# Altium schematic sheet seven_segment_driver_sche.SchDoc
size A
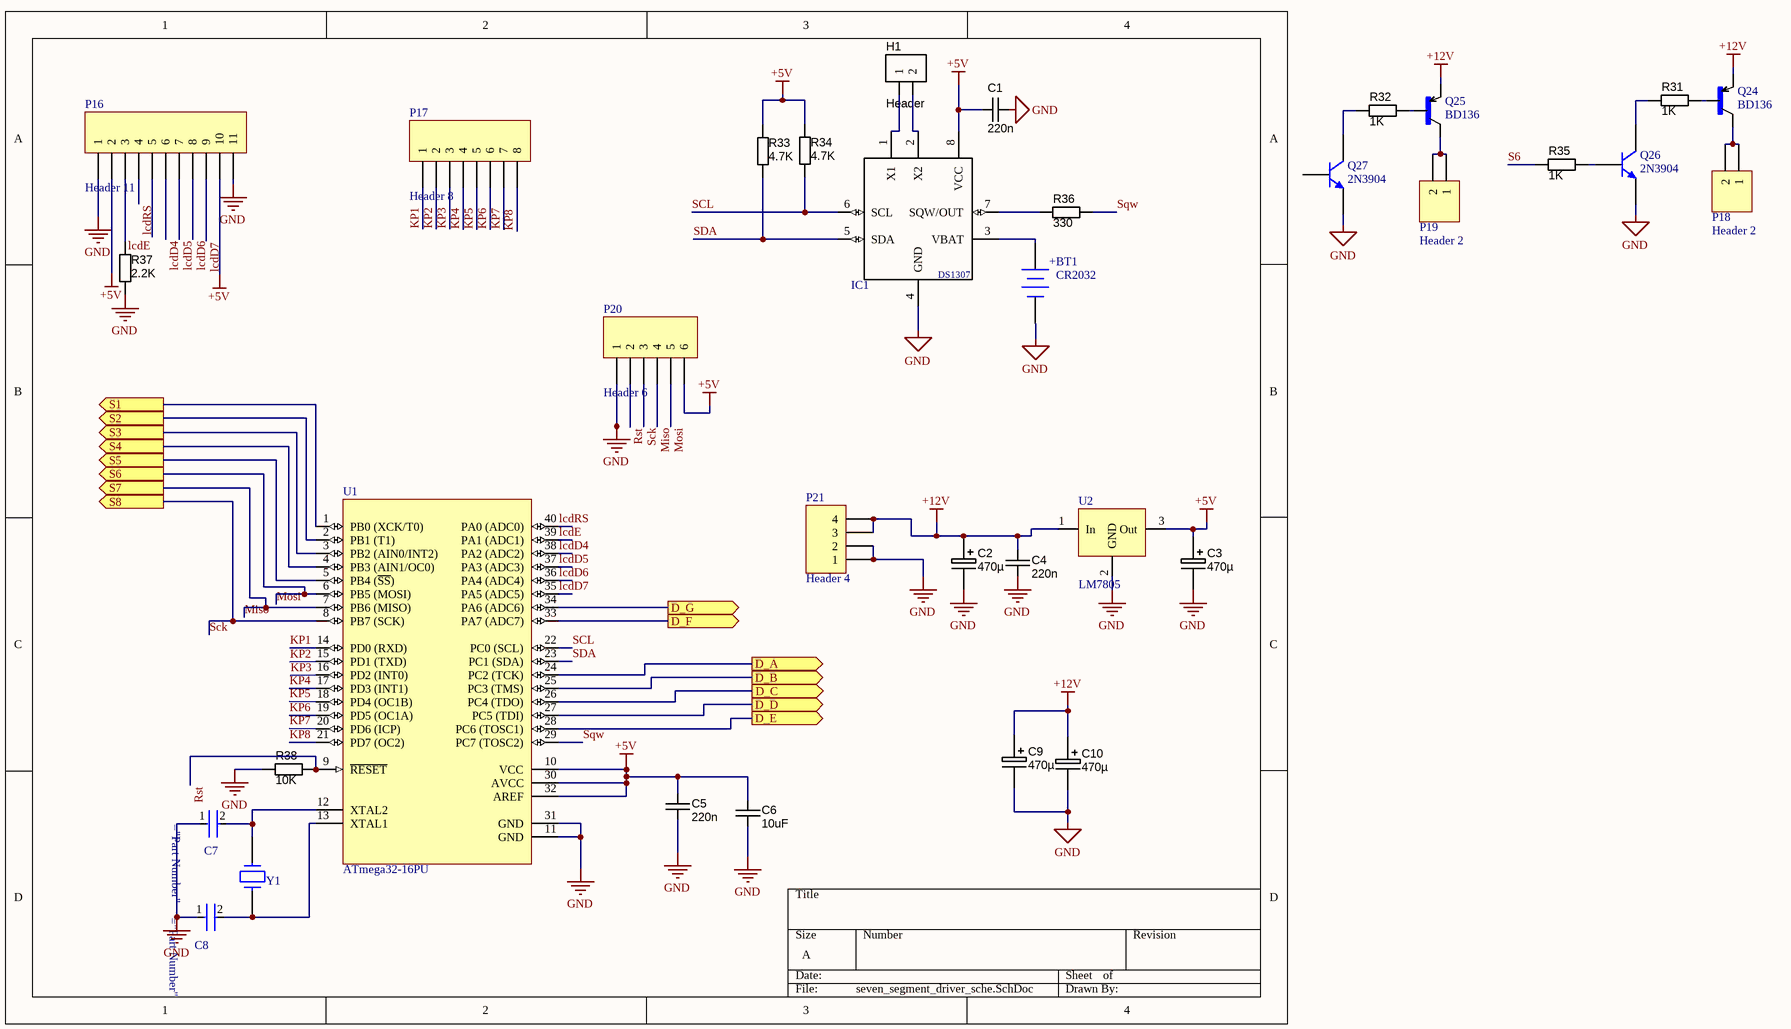
[diagram p0: seven_segment_driver_sche.SchDoc]

## Parts
BT1  CR2032  [CR2032 CELL HOLDER]
C1  value 220n  [CAPC500P450250X550]  (hidden comment: approved sub OK)
C2  470µ  [CAPE10.0MM_Rad_10x14mm]
C3  470µ  [CAPE10.0MM_Rad_10x14mm]
C4  value 220n  [CAPC500P450250X550]  (hidden comment: approved sub OK)
C5  value 220n  [CAPC500P450250X550]  (hidden comment: approved sub OK)
C6  value 10uF  [CAPE_5x11x2LS]  (hidden comment: approved sub OK)
C7  K220J15C0GF5TH5  [Vishay_K220J15_0]  (value not drawn)
C8  K220J15C0GF5TH5  [Vishay_K220J15_0]  (value not drawn)
C9  470µ  [CAPE10.0MM_Rad_10x14mm]
C10  470µ  [CAPE10.0MM_Rad_10x14mm]
H1  Header  [HDR_1x2_Offset]  (no BOM)
IC1  DS1307  [DIP8-300]  (value not drawn)
P16  Header 11  [HDR1X11]
P17  Header 8  [HDR1X8]
P18  Header 2  [HDR1X2]
P19  Header 2  [HDR1X2]
P20  Header 6  [HDR1X6]
P21  Header 4  [HDR1X4]
Q24  BD136  [*TO229P780X300X2000-3]
Q25  BD136  [*TO229P780X300X2000-3]
Q26  2N3904  [TO-92_Flat]
Q27  2N3904  [TO-92_Flat]
R31  value 1K  [RESTH_AXIAL-0.4]  (hidden comment: Carbon Film)
R32  value 1K  [RESTH_AXIAL-0.4]  (hidden comment: Carbon Film)
R33  value 4.7K  [RESTH_AXIAL-0.4]  (hidden comment: Carbon Film)
R34  value 4.7K  [RESTH_AXIAL-0.4]  (hidden comment: Carbon Film)
R35  value 1K  [RESTH_AXIAL-0.4]  (hidden comment: Carbon Film)
R36  value 330  [RESTH_AXIAL-0.4]  (hidden comment: Carbon Film)
R37  value 2.2K  [RESTH_AXIAL-0.4]  (hidden comment: Carbon Film)
R38  value 10K  [RESTH_AXIAL-0.4]  (hidden comment: Carbon Film)
U1  ATmega32-16PU  [40P6]
U2  LM7805  [To-254-AA]
Y1  4MHz  [Cristal mini]  (value not drawn)

## Ports
D_A (out), D_B (out), D_C (out), D_D (out), D_E (out), D_F (out), D_G (out), S1 (out), S2 (out), S3 (out), S4 (out), S5 (out), S6 (out), S7 (out), S8 (out)

## Nets
+5V: C1.1 C3.1 C5.1 C6.1 IC1.8(VCC) P16.2 P16.10 P20.6 R33.2 R34.2 U1.10(VCC) U1.30(AVCC) U1.32(AREF) U2.3(Out)
+12V: C2.1 C4.2 C9.1 C10.1 P21.3 P21.4 Q24.1(C) Q25.1(C) U2.1(In)
GND: BT1.2(-) C1.2 C2.2 C3.2 C4.1 C5.2 C6.2 C7.1 C8.1 C9.2 C10.2 IC1.4(GND) P16.1 P16.11 P20.1 P21.1 P21.2 Q26.1(E) Q27.1(E) R37.1 R38.1 U1.11(GND) U1.31(GND) U2.2(GND)
D_A: U1.24(PC2_(TCK)) ; port D_A
D_B: U1.25(PC3_(TMS)) ; port D_B
D_C: U1.26(PC4_(TDO)) ; port D_C
D_D: U1.27(PC5_(TDI)) ; port D_D
D_E: U1.28(PC6_(TOSC1)) ; port D_E
D_F: U1.33(PA7_(ADC7)) ; port D_F
D_G: U1.34(PA6_(ADC6)) ; port D_G
KP1: P17.1 U1.14(PD0_(RXD))
KP2: P17.2 U1.15(PD1_(TXD))
KP3: P17.3 U1.16(PD2_(INT0))
KP4: P17.4 U1.17(PD3_(INT1))
KP5: P17.5 U1.18(PD4_(OC1B))
KP6: P17.6 U1.19(PD5_(OC1A))
KP7: P17.7 U1.20(PD6_(ICP))
KP8: P17.8 U1.21(PD7_(OC2))
lcdD4: P16.6 U1.38(PA2_(ADC2))
lcdD5: P16.7 U1.37(PA3_(ADC3))
lcdD6: P16.8 U1.36(PA4_(ADC4))
lcdD7: P16.9 U1.35(PA5_(ADC5))
lcdE: P16.5 U1.39(PA1_(ADC1))
lcdRS: P16.4 U1.40(PA0_(ADC0))
Miso: P20.4 U1.7(PB6_(MISO)) ; port S7
Mosi: P20.5 U1.6(PB5_(MOSI)) ; port S6
Rst: P20.2 R38.2 U1.9(~{RESET})
S1: U1.1(PB0_(XCK/T0)) ; port S1
S2: U1.2(PB1_(T1)) ; port S2
S3: U1.3(PB2_(AIN0/INT2)) ; port S3
S4: U1.4(PB3_(AIN1/OC0)) ; port S4
S5: U1.5(PB4_(~{SS})) ; port S5
S6: R35.1
Sck: P20.3 U1.8(PB7_(SCK)) ; port S8
SCL: IC1.6(SCL) R34.1 U1.22(PC0_(SCL))
SDA: IC1.5(SDA) R33.1 U1.23(PC1_(SDA))
Sqw: R36.2 U1.29(PC7_(TOSC2))
NetBT1_1: BT1.1(+) IC1.3(VBAT)
NetC7_2: C7.2 U1.12(XTAL2) Y1.2
NetC8_2: C8.2 U1.13(XTAL1) Y1.1
NetH1_1: H1.1 IC1.1(X1)
NetH1_2: H1.2 IC1.2(X2)
NetIC1_7: IC1.7(SQW/OUT) R36.1
NetP16_3: P16.3 R37.2
NetP18_1: P18.1 P18.2 Q24.2(C)
NetP19_1: P19.1 P19.2 Q25.2(C)
NetQ24_3: Q24.3(B) R31.2
NetQ25_3: Q25.3(B) R32.2
NetQ26_2: Q26.2(B) R35.2
NetQ26_3: Q26.3(C) R31.1
NetQ27_3: Q27.3(C) R32.1

Not connected (* = marked no-connect by the designer): Q27 2(B)

## Library data of the parts
BT1 = CR2032 Cell Holder: Revised: Zion Blue; Published: 06-May-2014; LatestRevisionDate: 17-Jul-2002; LatestRevisionNote: Re-released for DXP Platform.; Publisher: Cynetik Group
C1 C4-C6 = CAPR_220n_Radial_5mm: Capacitor Ceramic 220nF 10% 50V X7R radial 5mm lead spacing; Manufacturer 1: TDK Corporation; Manufacturer Part Number 1: FK24X7R1H224K; Ratings: 50V; X7R; SCDType: spec; Tolerance: ±10%; Material: ceramic; Supplier 1: Digi-Key; Supplier Part Number 1: 445-2855-ND; Package / Case: 0.217" L x 0.177" W (5.50mm x 4.50mm) radial 5mm LS; Operating Temperature: -55°C ~ 125°C; ComponentLink1URL: http://www.tdk.co.jp/tefe02/e4941_fk.pdf; ComponentLink1Description: e4941_fk datasheet
C2 C3 C9 C10 = CAPE_470u_16V_THT: Capacitor THT Alum Elec 470uF 20% 16V; Manufacturer 1: NICHICON; Manufacturer Part Number 1: UHM1C471MPD6; Ratings: 16V; 105°C; Material: Al Electrolytic; SCDType: undef; Package / Case: Radial; Tolerance: ±20%; Supplier 1: Newark; Supplier Part Number 1: 54K8151; Manufacturer 2: JD; Manufacturer Part Number 2: GT470UF16V_10x12mm; Value: 470µ
H1 = Header2P: Header, 2-pin
IC1 = DS1307: Ic Rtc Clk/Calendar I2c 8-Dip; MF: Maxim Integrated; Availability: Unavailable; SnapEDA_Link: https://www.snapeda.com/parts/DS1307/Maxim%20Integrated/view-part/?ref=snap; MP: DS1307; Price: None; Package: DIP-8 Maxim Integrated; Value: *
P16 = Header 11: Header, 11-Pin; LatestRevisionDate: 17-Jul-2002; LatestRevisionNote: Re-released for DXP Platform.; Publisher: Altium Limited
P17 = Header 8: Header, 8-Pin; LatestRevisionDate: 17-Jul-2002; LatestRevisionNote: Re-released for DXP Platform.; Publisher: Altium Limited
P18 P19 = Header 2: Header, 2-Pin; LatestRevisionDate: 17-Jul-2002; LatestRevisionNote: Re-released for DXP Platform.; Publisher: Altium Limited
P20 = Header 6: Header, 6-Pin; LatestRevisionDate: 17-Jul-2002; LatestRevisionNote: Re-released for DXP Platform.; Publisher: Altium Limited
P21 = Header 4: Header, 4-Pin; LatestRevisionDate: 17-Jul-2002; LatestRevisionNote: Re-released for DXP Platform.; Publisher: Altium Limited
Q26 Q27 = 2N3904: NPN General Purpose Amplifier; Published: 8-Jun-2000; LatestRevisionDate: 15-Jan-2003; LatestRevisionNote: PCB Footprint 'BCY-W3/D4.7' replaced; DatasheetVersion: 1997; PackageVersion: Sep-1998; PackageReference: TO-92A; Publisher: Altium Limited; PackageDescription: TO, Flat Index; 3 In-Line, Axial Leads; Body Dia. 4.5mm; Leads 0.51 x 0.48 mm (max); ComponentLink1Description: Manufacturer Link; ComponentLink1URL: http://www.fairchildsemi.com/; ComponentLink2Description: Datasheet; ComponentLink2URL: http://www.fairchildsemi.com/ds/2N%2F2N3904.pdf
R31-R38 = RES_1K_Axial_0.25W_5%: Resistor THD Axial 1k Ohm 0.25W 5% Carbon Film; Manufacturer 1: Yageo; Manufacturer Part Number 1: CFR-25JB-1K0; Ratings: 1/4W; SCDType: spec; Tolerance: ±5%; Package / Case: Axial; Supplier 1: Digi-Key; Supplier Part Number 1: 1.0KQBK-ND
U1 = ATmega32-16PU: 8-bit AVR Microcontroller, 4.5-5.5V, 16MHz, 32KB Flash, 1024 Bytes EEPROM, 2KB SRAM, 40-pin PDIP, Industrial Grade (-40°C to 85°C); DatasheetVersion: revQ, Feb-2011; PackageVersion: revB, Sep-2001; PackageReference: 40P6; PackageDescription: 40-lead (0.600"/15.24mm Wide) Plastic Dual Inline Package (PDIP); Code_JEDEC: MS-011-AC; ComponentLink1Description: Manufacturer URL; ComponentLink1URL: http://www.atmel.com/; ComponentLink2Description: ATmega32(L) Datasheet; ComponentLink2URL: http://atmel.com/dyn/resources/prod_documents/doc2503.pdf; ComponentLink3Description: ATmega32(L) Summary; ComponentLink3URL: http://atmel.com/dyn/resources/prod_documents/2503S.pdf
U2 = LM7805: IC REG LIN 5V 1A
Y1 = Quartz Crystal: Published: 8 April 2014; Created By: Zion Blue; Publisher: Cynetik Group; Nominal Fequency: 4MHz